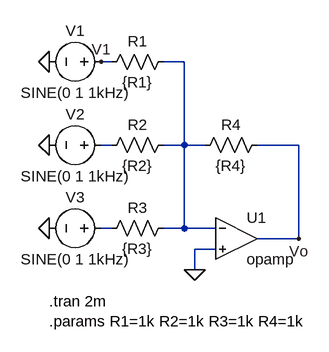
[diagram p0: schematic tut2ques20a.asc]
tut2ques20a.asc, the LTspice schematic file:
Version 4
SHEET 1 1024 680
WIRE -96 -112 -112 -112
WIRE 16 -112 -16 -112
WIRE -96 16 -112 16
WIRE 16 16 16 -112
WIRE 16 16 -16 16
WIRE 48 16 16 16
WIRE 192 16 128 16
WIRE -96 144 -112 144
WIRE 16 144 16 16
WIRE 16 144 -16 144
WIRE 64 144 16 144
WIRE 192 160 192 16
WIRE 192 160 128 160
WIRE 64 176 32 176
WIRE 32 208 32 176
FLAG 32 208 0
FLAG -192 -112 0
FLAG -192 16 0
FLAG -192 144 0
FLAG 192 160 Vo
FLAG -112 -112 V1
SYMBOL opamp 96 96 R0
SYMATTR InstName U1
SYMBOL voltage -96 -112 R90
WINDOW 0 -32 56 VBottom 2
WINDOW 3 32 56 VTop 2
SYMATTR InstName V1
SYMATTR Value SINE(0 1 1kHz)
SYMBOL voltage -96 16 R90
WINDOW 0 -32 56 VBottom 2
WINDOW 3 32 56 VTop 2
SYMATTR InstName V2
SYMATTR Value SINE(0 1 1kHz)
SYMBOL voltage -96 144 R90
WINDOW 0 -32 56 VBottom 2
WINDOW 3 32 56 VTop 2
SYMATTR InstName V3
SYMATTR Value SINE(0 1 1kHz)
SYMBOL res 0 -128 R90
WINDOW 0 0 56 VBottom 2
WINDOW 3 32 56 VTop 2
SYMATTR InstName R1
SYMATTR Value {R1}
SYMBOL res 0 0 R90
WINDOW 0 0 56 VBottom 2
WINDOW 3 32 56 VTop 2
SYMATTR InstName R2
SYMATTR Value {R2}
SYMBOL res 0 128 R90
WINDOW 0 0 56 VBottom 2
WINDOW 3 32 56 VTop 2
SYMATTR InstName R3
SYMATTR Value {R3}
SYMBOL res 144 0 R90
WINDOW 0 0 56 VBottom 2
WINDOW 3 32 56 VTop 2
SYMATTR InstName R4
SYMATTR Value {R4}
TEXT -192 256 Left 2 !.tran 2m\n.params R1=1k R2=1k R3=1k R4=1k

The netlist it stands for:
* tut2ques20a.asc
XU1 N001 0 Vo opamp Aol=100K GBW=10Meg  ; pins invin noninvin out
V1 V1 0 SINE(0 1 1kHz)
V2 N002 0 SINE(0 1 1kHz)
V3 N003 0 SINE(0 1 1kHz)
R1 N001 V1 {R1}
R2 N001 N002 {R2}
R3 N001 N003 {R3}
R4 Vo N001 {R4}
.tran 2m
.params R1=1k R2=1k R3=1k R4=1k
.backanno
.end